# Altium schematic sheet Cherry.SchDoc
size A4; PageSetup: Record=PageOptions|CenterHorizontal=True|CenterVertical=True|PrintScale=1.28|XCorrection=1.00|YCorrection=1.00|PrintKind=0|BorderSize=5000000|LeftOffset=0|BottomOffset=0|Orientation=2|PaperLength=1000|PaperWidth=1000|Scale=100|PaperSource=7|PrintQuality=-4|MediaType=1|DitherType=10|PaperKind=A3 297x420mm|PrintScaleMode=1; Organization: Electronic Research & Design; Address1: 11 Granofier; Address2: Zwartkop; Address3: Centurion; Address4: South Africa; Revision: 0
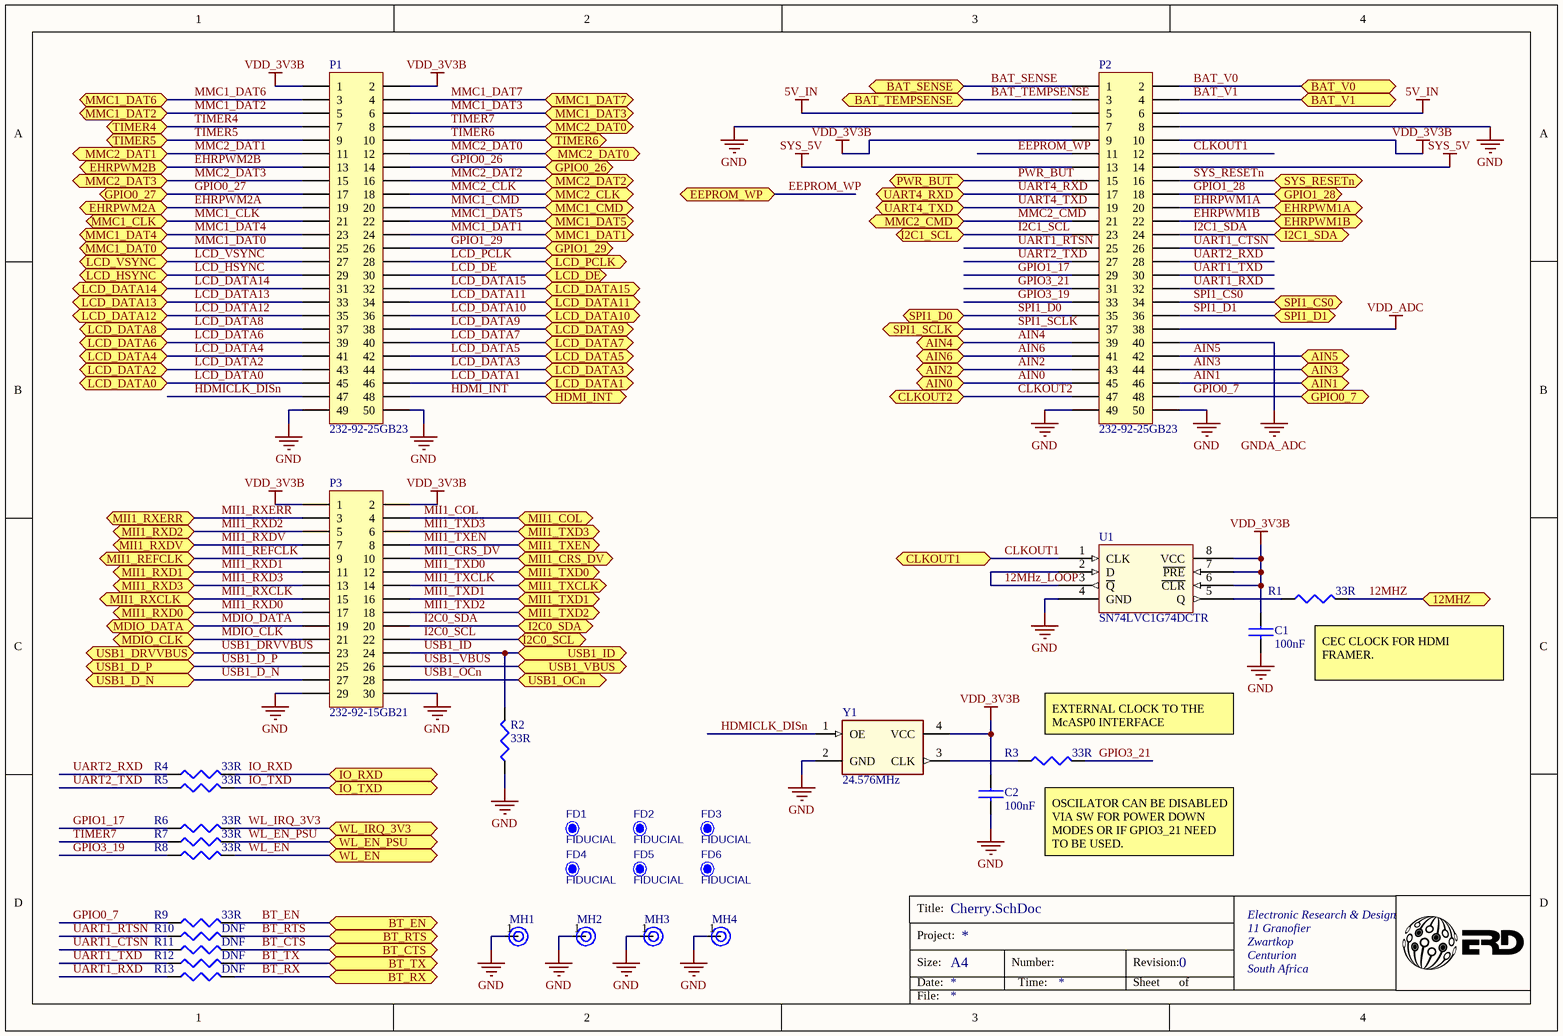
[diagram p0: Cherry.SchDoc]

## Parts
C1  100nF  [CC0402]
C2  100nF  [CC0402]
FD1  FIDUCIAL  [FIDUCIAL]
FD2  FIDUCIAL  [FIDUCIAL]
FD3  FIDUCIAL  [FIDUCIAL]
FD4  FIDUCIAL  [FIDUCIAL]
FD5  FIDUCIAL  [FIDUCIAL]
FD6  FIDUCIAL  [FIDUCIAL]
MH1  MH  [MH - M3]  (value not drawn)
MH2  MH  [MH - M3]  (value not drawn)
MH3  MH  [MH - M3]  (value not drawn)
MH4  MH  [MH - M3]  (value not drawn)
P1  232-92-25GB23  [232-92-25GB]
P2  232-92-25GB23  [232-92-25GB]
P3  232-92-15GB21  [232-92-15GB]
R1  33R  [RC0402]
R2  33R  [RC0402]
R3  33R  [RC0402]
R4  33R  [RC0402]
R5  33R  [RC0402]
R6  33R  [RC0402]
R7  33R  [RC0402]
R8  33R  [RC0402]
R9  33R  [RC0402]
R10  DNF  [RC0402]
R11  DNF  [RC0402]
R12  DNF  [RC0402]
R13  DNF  [RC0402]
U1  SN74LVC1G74DCTR  [SOP8_DCT]
Y1  24.576MHz  [OSC_SMD_7x5]

## Ports
12MHZ, AIN0, AIN1, AIN2, AIN3, AIN4, AIN5, AIN6, BAT_SENSE, BAT_TEMPSENSE, BAT_V0, BAT_V1, BT_CTS, BT_EN, BT_RTS, BT_RX, BT_TX, CLKOUT1, CLKOUT2, EEPROM_WP, EHRPWM1A, EHRPWM1B, EHRPWM2A, EHRPWM2B, GPIO0_7, GPIO0_26, GPIO0_27, GPIO1_28, GPIO1_29, HDMI_INT, I2C0_SCL, I2C0_SDA, I2C1_SCL, I2C1_SDA, IO_RXD, IO_TXD, LCD_DATA0, LCD_DATA1, LCD_DATA2, LCD_DATA3, LCD_DATA4, LCD_DATA5, LCD_DATA6, LCD_DATA7, LCD_DATA8, LCD_DATA9, LCD_DATA10, LCD_DATA11, LCD_DATA12, LCD_DATA13, LCD_DATA14, LCD_DATA15, LCD_DE, LCD_HSYNC, LCD_PCLK, LCD_VSYNC, MDIO_CLK, MDIO_DATA, MII1_COL, MII1_CRS_DV, MII1_REFCLK, MII1_RXCLK, MII1_RXD0, MII1_RXD1, MII1_RXD2, MII1_RXD3, MII1_RXDV, MII1_RXERR, MII1_TXCLK, MII1_TXD0, MII1_TXD1, MII1_TXD2, MII1_TXD3, MII1_TXEN, MMC1_CLK, MMC1_CMD, MMC1_DAT0, MMC1_DAT1, MMC1_DAT2, MMC1_DAT3, MMC1_DAT4, MMC1_DAT5, MMC1_DAT6, MMC1_DAT7, MMC2_CLK, MMC2_CMD, MMC2_DAT0, MMC2_DAT1, MMC2_DAT2, MMC2_DAT3, PWR_BUT, SPI1_CS0, SPI1_D0, SPI1_D1, SPI1_SCLK, SYS_RESETn, TIMER4, TIMER5, TIMER6, UART4_RXD, UART4_TXD, USB1_D_N, USB1_D_P, USB1_DRVVBUS, USB1_ID, USB1_OCn, USB1_VBUS, WL_EN, WL_EN_PSU, WL_IRQ_3V3

## Nets
5V_IN: P2.5 P2.6
GND: C1.2 C2.2 MH1.1 MH2.1 MH3.1 MH4.1 P1.49 P1.50 P2.7 P2.8 P2.49 P2.50 P3.29 P3.30 R2.1 U1.4(GND) Y1.2(GND)
GNDA_ADC: P2.40
SYS_5V: P2.13 P2.14
VDD_3V3B: C1.1 C2.1 P1.1 P1.2 P2.9 P2.10 P3.1 P3.2 U1.6(~{CLR}) U1.7(~{PRE}) U1.8(VCC) Y1.4(VCC)
VDD_ADC: P2.38
12MHZ: R1.2 ; port 12MHZ
12MHz_LOOP: U1.2(D) U1.3(~{Q})
AIN0: P2.45 ; port AIN0
AIN1: P2.46 ; port AIN1
AIN2: P2.43 ; port AIN2
AIN3: P2.44 ; port AIN3
AIN4: P2.39 ; port AIN4
AIN5: P2.42 ; port AIN5
AIN6: P2.41 ; port AIN6
BAT_SENSE: P2.1 ; port BAT_SENSE
BAT_TEMPSENSE: P2.3 ; port BAT_TEMPSENSE
BAT_V0: P2.2 ; port BAT_V0
BAT_V1: P2.4 ; port BAT_V1
BT_CTS: R11.2 ; port BT_CTS
BT_EN: R9.2 ; port BT_EN
BT_RTS: R10.2 ; port BT_RTS
BT_RX: R13.2 ; port BT_RX
BT_TX: R12.2 ; port BT_TX
CLKOUT1: P2.12 U1.1(CLK) ; port CLKOUT1
CLKOUT2: P2.47 ; port CLKOUT2
EEPROM_WP: P2.11 ; port EEPROM_WP
EHRPWM1A: P2.20 ; port EHRPWM1A
EHRPWM1B: P2.22 ; port EHRPWM1B
EHRPWM2A: P1.19 ; port EHRPWM2A
EHRPWM2B: P1.13 ; port EHRPWM2B
GPIO0_7: P2.48 R9.1 ; port GPIO0_7
GPIO0_26: P1.14 ; port GPIO0_26
GPIO0_27: P1.17 ; port GPIO0_27
GPIO1_17: P2.29 R6.1
GPIO1_28: P2.18 ; port GPIO1_28
GPIO1_29: P1.26 ; port GPIO1_29
GPIO3_19: P2.33 R8.1
GPIO3_21: P2.31 R3.2
HDMI_INT: P1.48 ; port HDMI_INT
HDMICLK_DISn: P1.47 Y1.1(OE)
I2C0_SCL: P3.22 ; port I2C0_SCL
I2C0_SDA: P3.20 ; port I2C0_SDA
I2C1_SCL: P2.23 ; port I2C1_SCL
I2C1_SDA: P2.24 ; port I2C1_SDA
IO_RXD: R4.2 ; port IO_RXD
IO_TXD: R5.2 ; port IO_TXD
LCD_DATA0: P1.45 ; port LCD_DATA0
LCD_DATA1: P1.46 ; port LCD_DATA1
LCD_DATA2: P1.43 ; port LCD_DATA2
LCD_DATA3: P1.44 ; port LCD_DATA3
LCD_DATA4: P1.41 ; port LCD_DATA4
LCD_DATA5: P1.42 ; port LCD_DATA5
LCD_DATA6: P1.39 ; port LCD_DATA6
LCD_DATA7: P1.40 ; port LCD_DATA7
LCD_DATA8: P1.37 ; port LCD_DATA8
LCD_DATA9: P1.38 ; port LCD_DATA9
LCD_DATA10: P1.36 ; port LCD_DATA10
LCD_DATA11: P1.34 ; port LCD_DATA11
LCD_DATA12: P1.35 ; port LCD_DATA12
LCD_DATA13: P1.33 ; port LCD_DATA13
LCD_DATA14: P1.31 ; port LCD_DATA14
LCD_DATA15: P1.32 ; port LCD_DATA15
LCD_DE: P1.30 ; port LCD_DE
LCD_HSYNC: P1.29 ; port LCD_HSYNC
LCD_PCLK: P1.28 ; port LCD_PCLK
LCD_VSYNC: P1.27 ; port LCD_VSYNC
MDIO_CLK: P3.21 ; port MDIO_CLK
MDIO_DATA: P3.19 ; port MDIO_DATA
MII1_COL: P3.4 ; port MII1_COL
MII1_CRS_DV: P3.10 ; port MII1_CRS_DV
MII1_REFCLK: P3.9 ; port MII1_REFCLK
MII1_RXCLK: P3.15 ; port MII1_RXCLK
MII1_RXD0: P3.17 ; port MII1_RXD0
MII1_RXD1: P3.11 ; port MII1_RXD1
MII1_RXD2: P3.5 ; port MII1_RXD2
MII1_RXD3: P3.13 ; port MII1_RXD3
MII1_RXDV: P3.7 ; port MII1_RXDV
MII1_RXERR: P3.3 ; port MII1_RXERR
MII1_TXCLK: P3.14 ; port MII1_TXCLK
MII1_TXD0: P3.12 ; port MII1_TXD0
MII1_TXD1: P3.16 ; port MII1_TXD1
MII1_TXD2: P3.18 ; port MII1_TXD2
MII1_TXD3: P3.6 ; port MII1_TXD3
MII1_TXEN: P3.8 ; port MII1_TXEN
MMC1_CLK: P1.21 ; port MMC1_CLK
MMC1_CMD: P1.20 ; port MMC1_CMD
MMC1_DAT0: P1.25 ; port MMC1_DAT0
MMC1_DAT1: P1.24 ; port MMC1_DAT1
MMC1_DAT2: P1.5 ; port MMC1_DAT2
MMC1_DAT3: P1.6 ; port MMC1_DAT3
MMC1_DAT4: P1.23 ; port MMC1_DAT4
MMC1_DAT5: P1.22 ; port MMC1_DAT5
MMC1_DAT6: P1.3 ; port MMC1_DAT6
MMC1_DAT7: P1.4 ; port MMC1_DAT7
MMC2_CLK: P1.18 ; port MMC2_CLK
MMC2_CMD: P2.21 ; port MMC2_CMD
MMC2_DAT0: P1.8 P1.12 R7.1 ; port MMC2_DAT0  [also labelled TIMER7]
MMC2_DAT1: P1.11 ; port MMC2_DAT1
MMC2_DAT2: P1.16 ; port MMC2_DAT2
MMC2_DAT3: P1.15 ; port MMC2_DAT3
PWR_BUT: P2.15 ; port PWR_BUT
SPI1_CS0: P2.34 ; port SPI1_CS0
SPI1_D0: P2.35 ; port SPI1_D0
SPI1_D1: P2.36 ; port SPI1_D1
SPI1_SCLK: P2.37 ; port SPI1_SCLK
SYS_RESETn: P2.16 ; port SYS_RESETn
TIMER4: P1.7 ; port TIMER4
TIMER5: P1.9 ; port TIMER5
TIMER6: P1.10 ; port TIMER6
UART1_CTSN: P2.26 R11.1
UART1_RTSN: P2.25 R10.1
UART1_RXD: P2.32 R13.1
UART1_TXD: P2.30 R12.1
UART2_RXD: P2.28 R4.1
UART2_TXD: P2.27 R5.1
UART4_RXD: P2.17 ; port UART4_RXD
UART4_TXD: P2.19 ; port UART4_TXD
USB1_D_N: P3.27 ; port USB1_D_N
USB1_D_P: P3.25 ; port USB1_D_P
USB1_DRVVBUS: P3.23 ; port USB1_DRVVBUS
USB1_ID: P3.24 R2.2 ; port USB1_ID
USB1_OCn: P3.28 ; port USB1_OCn
USB1_VBUS: P3.26 ; port USB1_VBUS
WL_EN: R8.2 ; port WL_EN
WL_EN_PSU: R7.2 ; port WL_EN_PSU
WL_IRQ_3V3: R6.2 ; port WL_IRQ_3V3
NetR1_1: R1.1 U1.5(Q)
NetR3_1: R3.1 Y1.3(CLK)

## Notes on the sheet
- (near R1) CEC CLOCK FOR HDMI FRAMER.
- (near R3) EXTERNAL CLOCK TO THE McASP0 INTERFACE
- (near R3) OSCILATOR CAN BE DISABLED VIA SW FOR POWER DOWN MODES OR IF GPIO3_21 NEED TO BE USED.
- Title:
- Size:
- Date:
- Project:
- A4
- Number:
- Time:
- Revision:
- Sheet
- of
- File:

## Library data of the parts
C1 C2 = CAP CER 0.1UF 10V 10% X5R 0402: CAP CER 0.1UF 50V 10% X7R 0402; Manufacturer: Murata; PartNumber: GCM155R71H104KE02D; Package / Case: 0402 (1005 Metric); Supplier: AAD
FD1-FD6 = FIDUCIAL: Fiducial 2mm
MH1-MH4 = MountingHole: Mounting Hole
P1 P2 = Header 25X2: Header, 25-Pin Male, Dual row; Manufacturer: Pinrex; Manufacturer Part Number: 635-92-25GB02; Supplier: AAD; Supplier Stock Code: N/A; Footprint: 635-72-25GB02
P3 = Header 15X2: Header, 15-Pin Male, Dual row; Manufacturer: Pinrex; Manufacturer Part Number: 635-92-15GB02; Supplier: AAD; Supplier Stock Code: N/A; Footprint: 635-72-15GB02
R1-R13 = RES_10K_1/16W_1%_0402: RES, 33 OHM, 1/16W, 1%, 0402; Manufacturer: Yageo; PartNumber: RC0402FR-0733RL; Package / Case: 0402 (1005 Metric); Supplier: AAD
U1 = SN74LVC1G74DCTR: SINGLE  POSITIVE-EDGE-TRIGGERED  D-TYPE  FLIP-FLOP WITH  CLEAR  AND  PRESET; Manufacturer: Texas Instruments; Function: Set(Preset) and Reset; Output Type: Differential; Number of Elements: 1; Frequency - Clock: 200MHz; Delay Time - Propagation: 1.6ns; Trigger Type: Positive Edge; Current - Output High, Low: 32mA, 32mA; Voltage - Supply: 1.65 V ~ 5.5 V; Supplier 1: Digi-Key; Supplier Part Number 1: 296-25553-6-ND; Manufacturer Part Number: SN74LVC1G74DCTR; RoHS: RoHS Compliant; Category: Integrated Circuits (ICs); Stock 1: 131; Pricing 1: 1=0.59, 10=0.494, 25=0.4332, 100=0.3708, 250=0.3216, 500=0.2724, 1000=0.21 (USD); Type: D-Type; Number of Bits per Element: 1; Operating Temperature: -40°C ~ 125°C; Mounting Type: Surface Mount; Package / Case: 8-LSSOP (0.11", 2.80mm Width); Packaging: Digi-Reel®; ComponentLink1URL: http://media.digikey.com/pdf/Data%20Sheets/Texas%20Instruments%20PDFs/SN74LVC1G74.pdf; ComponentLink1Description: http://media.digikey.com/pdf/Data%20Sheets/Texas%20Instruments%20PDFs/SN74LVC1G74.pdf
Y1 = ASDMB: Manufacturer: Abracon Corporation; Manufacturer Part Number: ASDMB-24.576MHZ-LC-T; Function: Standby (Power Down); Output: CMOS; Voltage - Supply: 1.8 V ~ 3.3 V; Frequency Stability: ±50ppm; Current - Supply (Max): 16mA; Current - Supply (Disable) (Max): 15µA; Supplier 1: Digi-Key; Supplier Part Number 1: 535-11729-6-ND; RoHS: RoHS Compliant; Category: Crystals and Oscillators; Stock 1: 0; Pricing 1: 1=1.69, 10=1.463, 50=1.2826, 100=1.0125, 500=0.855 (USD); Type: MEMS (Silicon); Frequency: 24.576MHz; Operating Temperature: -40°C ~ 85°C; Ratings: -; Mounting Type: Surface Mount; Size / Dimension: 0.098" L x 0.079" W (2.50mm x 2.00mm); Height: 0.035" (0.90mm); Package / Case: 4-SMD, No Lead (DFN, LCC); Packaging: Digi-Reel®; ComponentLink1URL: http://www.abracon.com/Oscillators/ASDMB.pdf; ComponentLink1Description: http://www.abracon.com/Oscillators/ASDMB.pdf